# EAGLE design FEZ Panda (EAGLE 5.04)
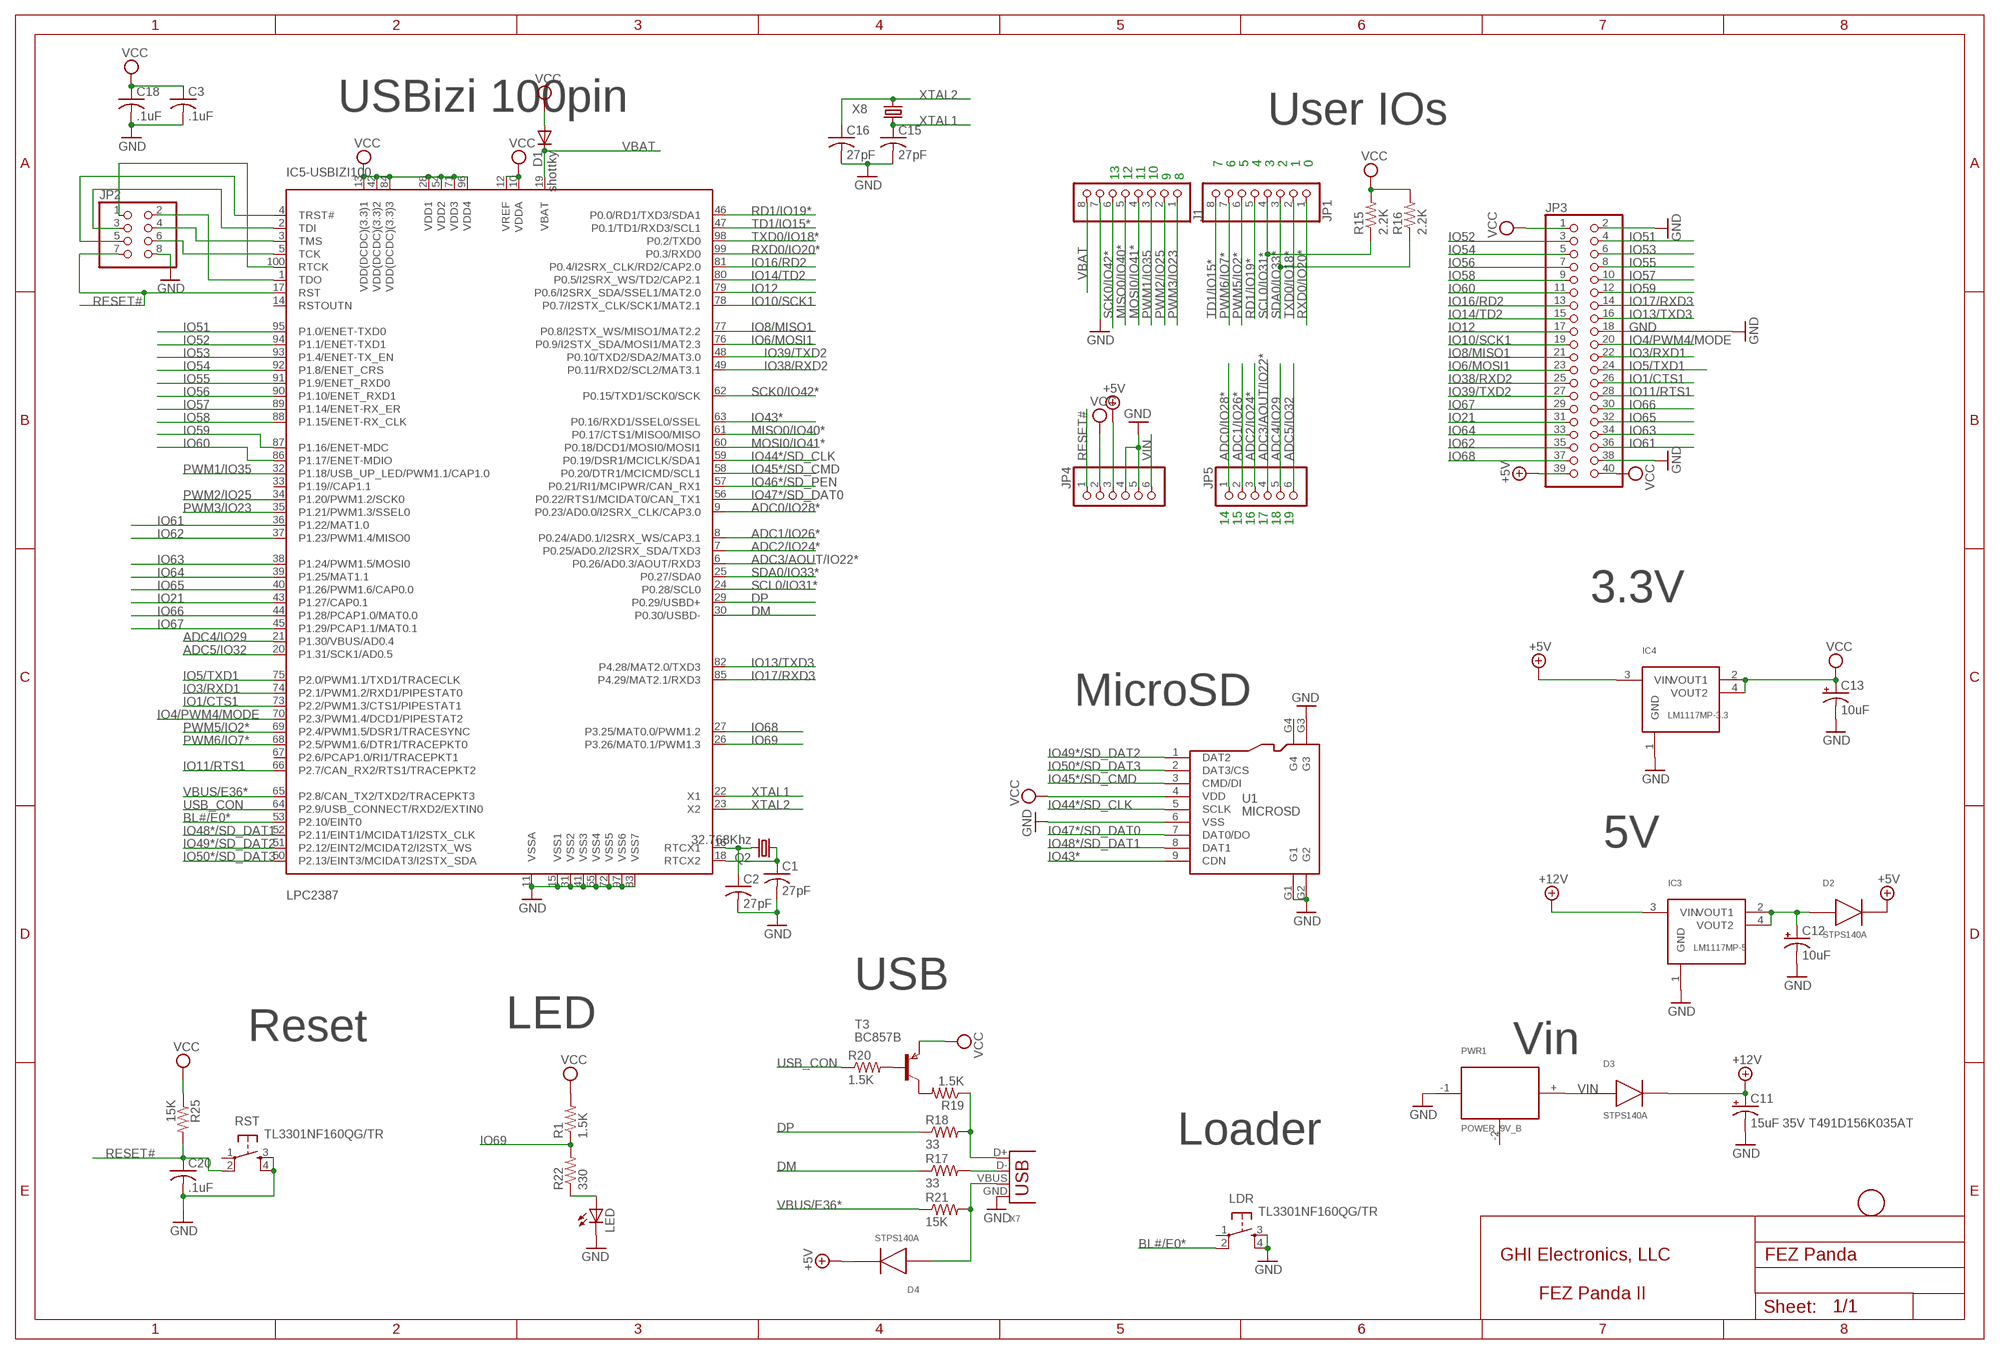
[diagram p0: schematic, sheet 1]

## Parts
C1  27pF  C-USC0603K  [C0603K]
C2  27pF  C-USC0603K  [C0603K]
C3  .1uF  C-USC0603K  [C0603K]
C11  15uF 35V T491D156K035AT  CPOL-USD/7343-31W  [D/7343-31W]
C12  10uF  CPOL-USCT3528  [CT3528]
C13  10uF  CPOL-USCT3528  [CT3528]
C15  27pF  C-USC0603K  [C0603K]
C16  27pF  C-USC0603K  [C0603K]
C18  .1uF  C-USC0603K  [C0603K]
C20  .1uF  C-USC0603K  [C0603K]
D1  shottky  DIODE-SOD323-W  [SOD323-W]
D2  STPS140A  DIODE_SMA  [DIODE_SMA]
D3  STPS140A  DIODE_SMA  [DIODE_SMA]
D4  STPS140A  DIODE_SMA  [DIODE_SMA]
IC3  LM1117MP-5  LM1117  [SOT223]
IC4  LM1117MP-3.3  LM1117  [SOT223]
IC5-USBIZI100  LPC2387  LPC2368  [LQFP100]
J1  PINHD-1X8  [1X08]
JP1  PINHD-1X8  [1X08]
JP2  PINHD-2X4  [2X04]
JP3  PINHD-2X20  [2X20]
JP4  PINHD-1X6  [1X06]
JP5  PINHD-1X6  [1X06]
LDR  TL3301NF160QG/TR  DTSM-6  [DTSM-6]
LED  LEDCHIPLED_0805  [CHIPLED_0805]
PWR1  POWER_9V_B  [POWER_9V_B]
Q2  32.768Khz  CRYSTALTC38H  [TC38H]
R1  1.5K  R-US_R0603  [R0603]
R15  2.2K  R-US_R0603  [R0603]
R16  2.2K  R-US_R0603  [R0603]
R17  33  R-US_R0603  [R0603]
R18  33  R-US_R0603  [R0603]
R19  1.5K  R-US_R0603  [R0603]
R20  1.5K  R-US_R0603  [R0603]
R21  15K  R-US_R0603  [R0603]
R22  330  R-US_R0603  [R0603]
R25  15K  R-US_R0603  [R0603]
RST  TL3301NF160QG/TR  DTSM-6  [DTSM-6]
T3  BC857B  PNPSOT23  [SOT-23]
U1  MICROSD  [MICROSD]
U$1  FIDUCIALMOUNT  [FIDUCIA-MOUNT]
X7  DX2R005HN2E700  USB-MB-S  [USB-MB-S]
X8  12Mhz  CRYTALSM49  [SM49@1]

## Nets
+5V: D2.K D4.K IC4.3(VIN) JP3.39 JP4.3
+12V: C11.+ D3.K IC3.3(VIN)
ADC0/IO28*: IC5-USBIZI100.9(P0.23/AD0.0/I2SRX_CLK/CAP3.0) JP5.1
ADC1/IO26*: IC5-USBIZI100.8(P0.24/AD0.1/I2SRX_WS/CAP3.1) JP5.2
ADC2/IO24*: IC5-USBIZI100.7(P0.25/AD0.2/I2SRX_SDA/TXD3) JP5.3
ADC3/AOUT/IO22*: IC5-USBIZI100.6(P0.26/AD0.3/AOUT/RXD3) JP5.4
ADC4/IO29: IC5-USBIZI100.21(P1.30/VBUS/AD0.4) JP5.5
ADC5/IO32: IC5-USBIZI100.20(P1.31/SCK1/AD0.5) JP5.6
BL#/E0*: IC5-USBIZI100.53(P2.10/EINT0) LDR.2
DM: IC5-USBIZI100.30(P0.30/USBD-) R17.1
DP: IC5-USBIZI100.29(P0.29/USBD+) R18.1
GND: C1.2 C2.2 C3.2 C11.- C12.- C13.- C15.2 C16.2 C18.2 C20.2 IC3.1(GND) IC4.1(GND) IC5-USBIZI100.11(VSSA) IC5-USBIZI100.15(VSS1) IC5-USBIZI100.31(VSS2) IC5-USBIZI100.41(VSS3) IC5-USBIZI100.55(VSS4) IC5-USBIZI100.72(VSS5) IC5-USBIZI100.83(VSS7) IC5-USBIZI100.97(VSS6) J1.7 JP2.8 JP3.2 JP3.18 JP3.38 JP4.4 JP4.5 LDR.3 LDR.4 LED.C PWR1.-1 RST.3 RST.4 U1.6(VSS) U1.G1 U1.G2 U1.G3 X7.GND
IO1/CTS1: IC5-USBIZI100.73(P2.2/PWM1.3/CTS1/PIPESTAT1) JP3.26
IO3/RXD1: IC5-USBIZI100.74(P2.1/PWM1.2/RXD1/PIPESTAT0) JP3.22
IO4/PWM4/MODE: IC5-USBIZI100.70(P2.3/PWM1.4/DCD1/PIPESTAT2) JP3.20
IO5/TXD1: IC5-USBIZI100.75(P2.0/PWM1.1/TXD1/TRACECLK) JP3.24
IO6/MOSI1: IC5-USBIZI100.76(P0.9/I2STX_SDA/MOSI1/MAT2.3) JP3.23
IO8/MISO1: IC5-USBIZI100.77(P0.8/I2STX_WS/MISO1/MAT2.2) JP3.21
IO10/SCK1: IC5-USBIZI100.78(P0.7/I2STX_CLK/SCK1/MAT2.1) JP3.19
IO11/RTS1: IC5-USBIZI100.66(P2.7/CAN_RX2/RTS1/TRACEPKT2) JP3.28
IO12: IC5-USBIZI100.79(P0.6/I2SRX_SDA/SSEL1/MAT2.0) JP3.17
IO13/TXD3: IC5-USBIZI100.82(P4.28/MAT2.0/TXD3) JP3.16
IO14/TD2: IC5-USBIZI100.80(P0.5/I2SRX_WS/TD2/CAP2.1) JP3.15
IO16/RD2: IC5-USBIZI100.81(P0.4/I2SRX_CLK/RD2/CAP2.0) JP3.13
IO17/RXD3: IC5-USBIZI100.85(P4.29/MAT2.1/RXD3) JP3.14
IO21: IC5-USBIZI100.43(P1.27/CAP0.1) JP3.31
IO38/RXD2: IC5-USBIZI100.49(P0.11/RXD2/SCL2/MAT3.1) JP3.25
IO39/TXD2: IC5-USBIZI100.48(P0.10/TXD2/SDA2/MAT3.0) JP3.27
IO43*: IC5-USBIZI100.63(P0.16/RXD1/SSEL0/SSEL) U1.9(CDN)
IO44*/SD_CLK: IC5-USBIZI100.59(P0.19/DSR1/MCICLK/SDA1) U1.5(SCLK)
IO45*/SD_CMD: IC5-USBIZI100.58(P0.20/DTR1/MCICMD/SCL1) U1.3(CMD/DI)
IO46*/SD_PEN: IC5-USBIZI100.57(P0.21/RI1/MCIPWR/CAN_RX1)
IO47*/SD_DAT0: IC5-USBIZI100.56(P0.22/RTS1/MCIDAT0/CAN_TX1) U1.7(DAT0/DO)
IO48*/SD_DAT1: IC5-USBIZI100.52(P2.11/EINT1/MCIDAT1/I2STX_CLK) U1.8(DAT1)
IO49*/SD_DAT2: IC5-USBIZI100.51(P2.12/EINT2/MCIDAT2/I2STX_WS) U1.1(DAT2)
IO50*/SD_DAT3: IC5-USBIZI100.50(P2.13/EINT3/MCIDAT3/I2STX_SDA) U1.2(DAT3/CS)
IO51: IC5-USBIZI100.95(P1.0/ENET-TXD0) JP3.4
IO52: IC5-USBIZI100.94(P1.1/ENET-TXD1) JP3.3
IO53: IC5-USBIZI100.93(P1.4/ENET-TX_EN) JP3.6
IO54: IC5-USBIZI100.92(P1.8/ENET_CRS) JP3.5
IO55: IC5-USBIZI100.91(P1.9/ENET_RXD0) JP3.8
IO56: IC5-USBIZI100.90(P1.10/ENET_RXD1) JP3.7
IO57: IC5-USBIZI100.89(P1.14/ENET-RX_ER) JP3.10
IO58: IC5-USBIZI100.88(P1.15/ENET-RX_CLK) JP3.9
IO59: IC5-USBIZI100.87(P1.16/ENET-MDC) JP3.12
IO60: IC5-USBIZI100.86(P1.17/ENET-MDIO) JP3.11
IO61: IC5-USBIZI100.36(P1.22/MAT1.0) JP3.36
IO62: IC5-USBIZI100.37(P1.23/PWM1.4/MISO0) JP3.35
IO63: IC5-USBIZI100.38(P1.24/PWM1.5/MOSI0) JP3.34
IO64: IC5-USBIZI100.39(P1.25/MAT1.1) JP3.33
IO65: IC5-USBIZI100.40(P1.26/PWM1.6/CAP0.0) JP3.32
IO66: IC5-USBIZI100.44(P1.28/PCAP1.0/MAT0.0) JP3.30
IO67: IC5-USBIZI100.45(P1.29/PCAP1.1/MAT0.1) JP3.29
IO68: IC5-USBIZI100.27(P3.25/MAT0.0/PWM1.2) JP3.37
IO69: IC5-USBIZI100.26(P3.26/MAT0.1/PWM1.3) R1.1 R22.2
MISO0/IO40*: IC5-USBIZI100.61(P0.17/CTS1/MISO0/MISO) J1.5
MOSI0/IO41*: IC5-USBIZI100.60(P0.18/DCD1/MOSI0/MOSI1) J1.4
N$1: IC5-USBIZI100.2(TDI) JP2.3
N$2: IC5-USBIZI100.3(TMS) JP2.4
N$3: IC5-USBIZI100.5(TCK) JP2.6
N$4: IC5-USBIZI100.100(RTCK) JP2.1
N$5: IC5-USBIZI100.1(TDO) JP2.2
N$6: R18.2 R19.1 X7.D+
N$7: R17.2 X7.D-
N$8: R20.2 T3.3(B)
N$9: IC5-USBIZI100.4(TRST#) JP2.5
N$10: R19.2 T3.1(C)
N$11: D4.A R21.2 X7.VBUS
N$12: LED.A R22.1
N$13: C2.1 IC5-USBIZI100.16(RTCX1) Q2.2
N$14: C1.1 IC5-USBIZI100.18(RTCX2) Q2.1
N$15: C12.+ D2.A IC3.2(VOUT1) IC3.4(VOUT2)
PWM1/IO35: IC5-USBIZI100.32(P1.18/USB_UP_LED/PWM1.1/CAP1.0) J1.3
PWM2/IO25: IC5-USBIZI100.34(P1.20/PWM1.2/SCK0) J1.2
PWM3/IO23: IC5-USBIZI100.35(P1.21/PWM1.3/SSEL0) J1.1
PWM5/IO2*: IC5-USBIZI100.69(P2.4/PWM1.5/DSR1/TRACESYNC) JP1.6
PWM6/IO7*: IC5-USBIZI100.68(P2.5/PWM1.6/DTR1/TRACEPKT0) JP1.7
RD1/IO19*: IC5-USBIZI100.46(P0.0/RD1/TXD3/SDA1) JP1.5
RESET#: C20.1 IC5-USBIZI100.17(RST) JP2.7 JP4.1 R25.2 RST.2
RXD0/IO20*: IC5-USBIZI100.99(P0.3/RXD0) JP1.1
SCK0/IO42*: IC5-USBIZI100.62(P0.15/TXD1/SCK0/SCK) J1.6
SCL0/IO31*: IC5-USBIZI100.24(P0.28/SCL0) JP1.4 R15.1
SDA0/IO33*: IC5-USBIZI100.25(P0.27/SDA0) JP1.3 R16.1
TD1/IO15*: IC5-USBIZI100.47(P0.1/TD1/RXD3/SCL1) JP1.8
TXD0/IO18*: IC5-USBIZI100.98(P0.2/TXD0) JP1.2
USB_CON: IC5-USBIZI100.64(P2.9/USB_CONNECT/RXD2/EXTIN0) R20.1
VBAT: D1.C IC5-USBIZI100.19(VBAT) J1.8
VBUS/E36*: IC5-USBIZI100.65(P2.8/CAN_TX2/TXD2/TRACEPKT3) R21.1
VCC: C3.1 C13.+ C18.1 D1.A IC4.2(VOUT1) IC4.4(VOUT2) IC5-USBIZI100.10(VDDA) IC5-USBIZI100.12(VREF) IC5-USBIZI100.13(VDD(DCDC)(3.3)1) IC5-USBIZI100.28(VDD1) IC5-USBIZI100.42(VDD(DCDC)(3.3)2) IC5-USBIZI100.54(VDD2) IC5-USBIZI100.71(VDD3) IC5-USBIZI100.84(VDD(DCDC)(3.3)3) IC5-USBIZI100.96(VDD4) JP3.1 JP3.40 JP4.2 R1.2 R15.2 R16.2 R25.1 T3.2(E) U1.4(VDD)
VIN: D3.A JP4.6 PWR1.+
XTAL1: C15.1 IC5-USBIZI100.22(X1) X8.1
XTAL2: C16.1 IC5-USBIZI100.23(X2) X8.2
Unconnected: IC5-USBIZI100.14(RSTOUTN) IC5-USBIZI100.33(P1.19//CAP1.1) IC5-USBIZI100.67(P2.6/PCAP1.0/RI1/TRACEPKT1) LDR.1 PWR1.-2 RST.1 U1.G4

## Notes on the sheet
- USBizi 100pin | User IOs
- 7 | 6 | 5 | 4 | 3 | 2 | 1 | 0
- 13 | 12 | 11 | 10 | 9 | 8
- 14 | 15 | 16 | 17 | 18 | 19
- 3.3V
- MicroSD
- 5V
- USB
- Reset | LED
- Vin
- Loader
- GHI Electronics, LLC
- FEZ Panda II

## Library data of the parts
C1-C3 C15 C16 C18 C20 = rcl:C-US: CAPACITOR, American symbol
C11-C13 = rcl:CPOL-US: POLARIZED CAPACITOR, American symbol
D1 = diode:DIODE-: DIODE
D2-D4 = GHI:DIODE_SMA
IC3 IC4 = GHI:LM1117
IC5-USBIZI100 = GHI:LPC2368
J1 JP1 = pinhead:PINHD-1X8: PIN HEADER
JP2 = pinhead:PINHD-2X4: PIN HEADER
JP3 = pinhead:PINHD-2X20: PIN HEADER
JP4 JP5 = pinhead:PINHD-1X6: PIN HEADER
LDR RST = switch-tact:DTSM-6
LED = led:LED: LED OSRAM: - CHIPLED LG R971, LG N971, LY N971, LG Q971, LY Q971, LO R971, LY R971 LH N974, LH R974 LS Q976, LO Q976, LY Q976 LO Q996 - Hyper CHIPLED LW Q18S LB Q993, LB Q99A, LB R99A - SideLED LS A670, LO A670, LY A670, LG A670, LP A670 LB A673, LV A673, LT A673, LW A673 LH A674 LY A675 LS A676, LA A676, LO A676, LY A676, LW A676 LS A679, LY A679, LG A679 - Hyper Micro SIDELED® LS Y876, LA Y876, LO Y876, LY Y876 LT Y87S - SmartLED LW L88C, LW L88S LB L89C, LB L89S, LG L890 LS L89K, LO L89K, LY L89K LS L896, LA L896, LO L896, LY L896 - TOPLED LS T670, LO T670, LY T670, LG T670, LP T670 LSG T670, LSP T670, LSY T670, LOP T670, LYG T670 LG T671, LOG T671, LSG T671 LB T673, LV T673, LT T673, LW T673 LH T674 LS T676, LA T676, LO T676, LY T676, LB T676, LH T676, LSB T676, LW T676 LB T67C, LV T67C, LT T67C, LS T67K, LO T67K, LY T67K, LW E67C LS E67B, LA E67B, LO E67B, LY E67B, LB E67C, LV E67C, LT E67C LW T67C LS T679, LY T679, LG T679 LS T770, LO T770, LY T770, LG T770, LP T770 LB T773, LV T773, LT T773, LW T773 LH T774 LS E675, LA E675, LY E675, LS T675 LS T776, LA T776, LO T776, LY T776, LB T776 LHGB T686 LT T68C, LB T68C - Hyper Mini TOPLED® LB M676 - Mini TOPLED Santana® LG M470 LS M47K, LO M47K, LY M47K Source: http://www.osram.convergy.de LUXEON: - LUMILED® LXK2-PW12-R00, LXK2-PW12-S00, LXK2-PW14-U00, LXK2-PW14-V00 LXK2-PM12-R00, LXK2-PM12-S00, LXK2-PM14-U00 LXK2-PE12-Q00, LXK2-PE12-R00, LXK2-PE12-S00, LXK2-PE14-T00, LXK2-PE14-U00 LXK2-PB12-K00, LXK2-PB12-L00, LXK2-PB12-M00, LXK2-PB14-N00, LXK2-PB14-P00, LXK2-PB14-Q00 LXK2-PR12-L00, LXK2-PR12-M00, LXK2-PR14-Q00, LXK2-PR14-R00 LXK2-PD12-Q00, LXK2-PD12-R00, LXK2-PD12-S00 LXK2-PH12-R00, LXK2-PH12-S00 LXK2-PL12-P00, LXK2-PL12-Q00, LXK2-PL12-R00 Source: www.luxeon.com KINGBRIGHT: KA-3528ASYC Source: www.kingbright.com
PWR1 = CONNECTER:POWER_9V_B
Q2 = crystal:CRYSTAL: CRYSTAL
R1 R15-R22 R25 = rcl:R-US_: RESISTOR, American symbol
T3 = zetex:PNPSOT23: PNP TRANSISTOR
U1 = microSD:MICROSD
U$1 = SmartPrj:FIDUCIALMOUNT
X7 = con-usb-3:USB: USB Connectors
X8 = crystal:CRYTAL: CRYSTAL

## Net classes
0 default: width 0.254 mm, drill 0.381 mm, clearance 0.203 mm
2 gnd: width 0.254 mm, drill 0.381 mm, clearance 0.203 mm
3 usbvcc: width 0.508 mm, drill 0.508 mm, clearance 2.235 mm

## Board
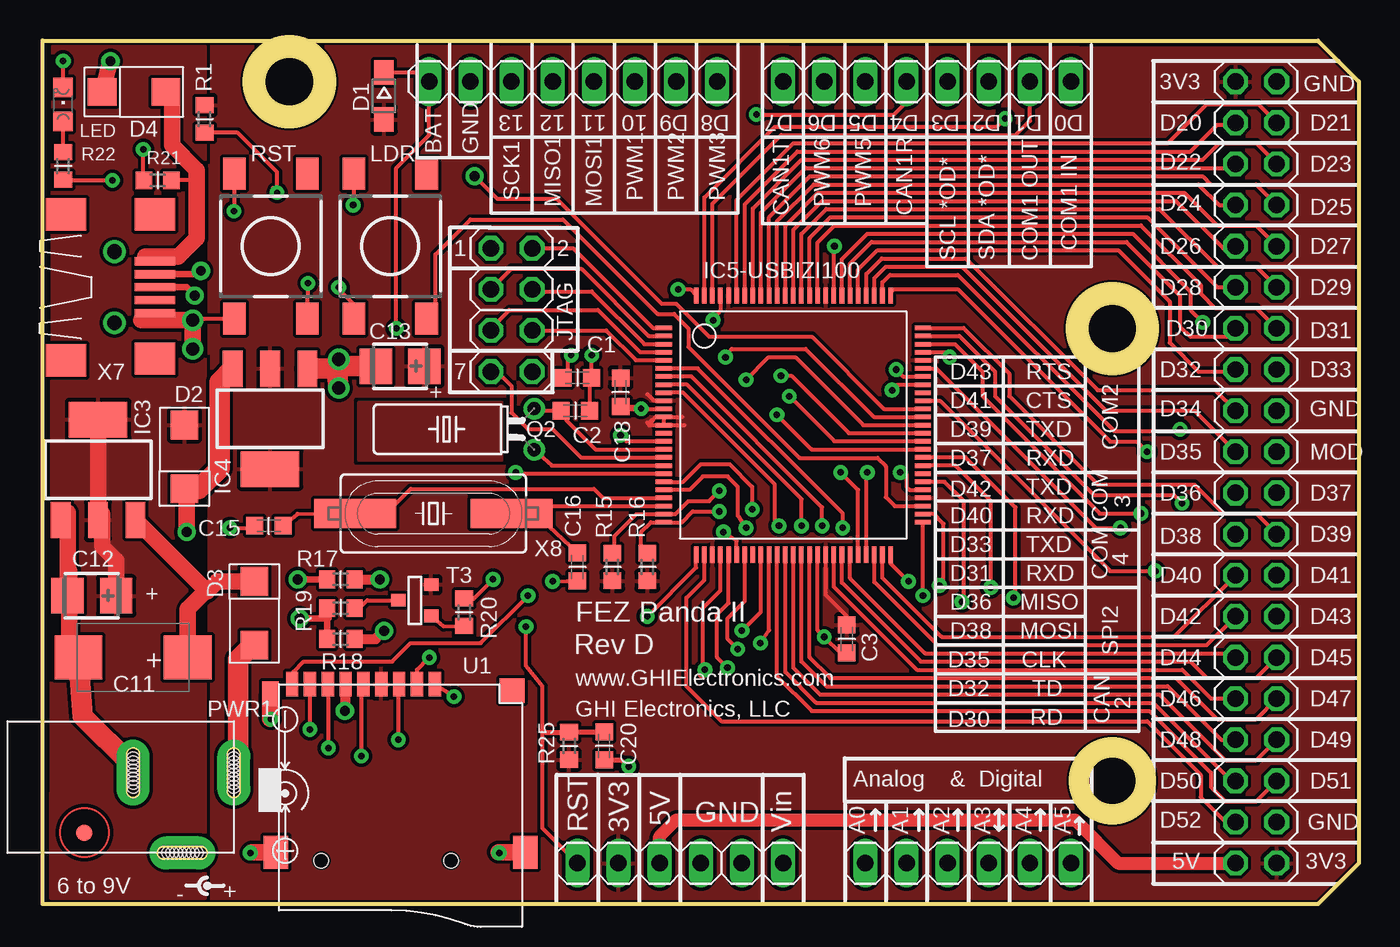
[diagram p1: board, top side]
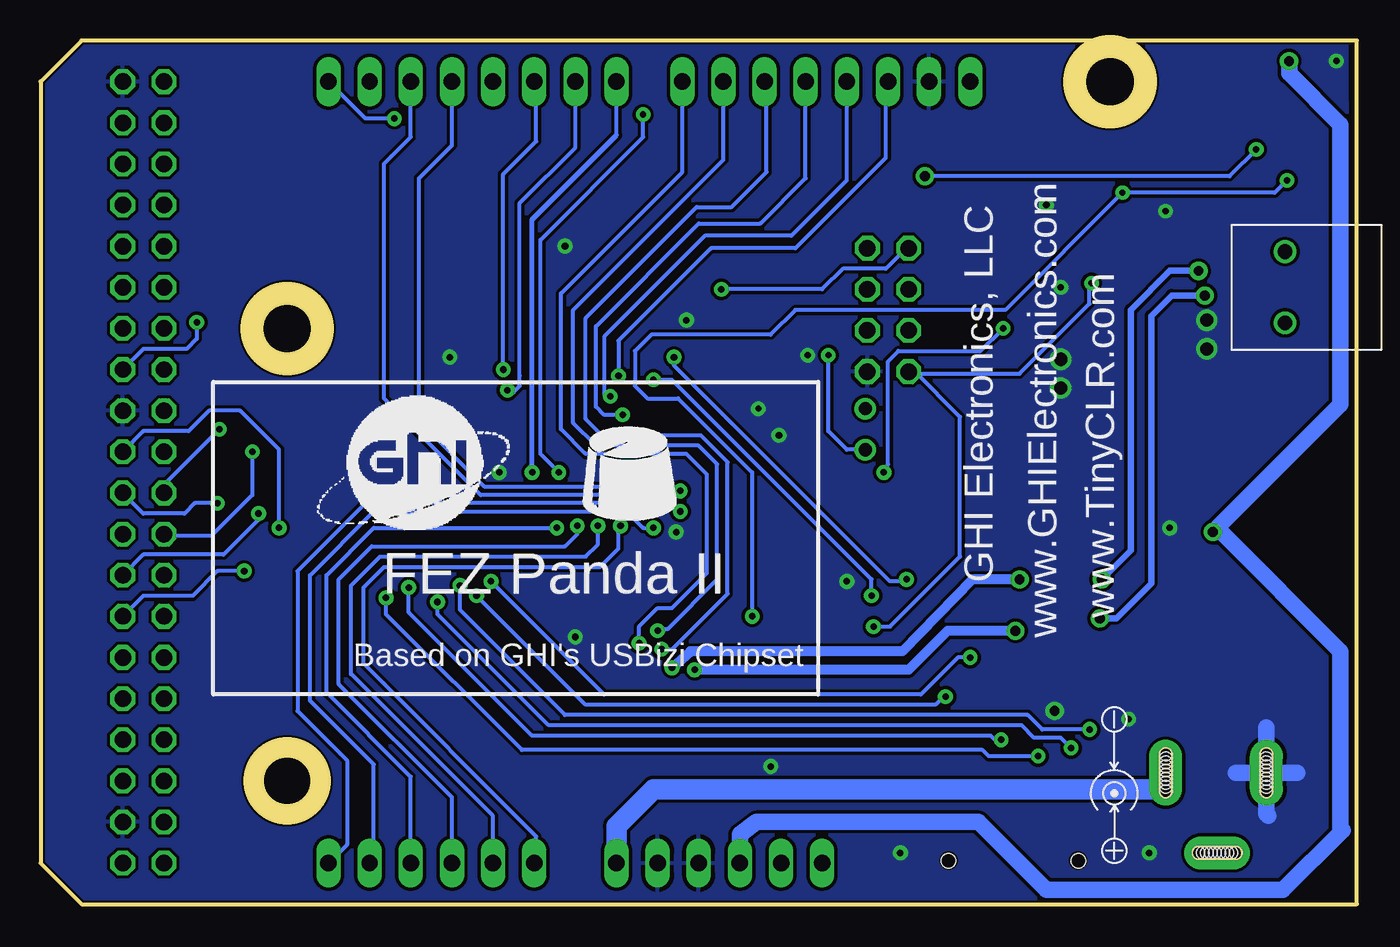
[diagram p2: board, bottom side, seen from below]

Size 81.28 x 53.34 mm. Coordinates in mm from the lower left corner, seen from the top.
Outline: 78.74,53.34 81.28,50.8 81.28,2.54 78.74,0 0,0 0,53.34 78.74,53.34
Outline: circle at 66.04,35.56 radius 2.16
Outline: circle at 15.24,50.8 radius 2.16
Outline: circle at 66.04,7.62 radius 2.05
Copper layers (1+16): Top 0.035mm / dielectric 1.5mm / Bottom 0.035mm
Design rules "default *": minimum track width 6mil, minimum drill 12mil, track to track 6mil, track to pad 6mil, pad to pad 6mil, via to via 6mil, smd to smd 6mil, copper to edge 5mil, drill to drill 6mil, minimum pad ring 10mil, minimum via ring 10mil, stop-mask expansion 10mil, vias tented up to drill 32mil, thermal gap 10mil
Holes 3.2 mm at 66.04,35.56 66.04,7.62 15.24,50.8

### Footprints (pad centres in the part's own frame; a part is rotated, then mirrored left to right if it is on the bottom)
C0603K = smd 1.05 x 1.08: 1 -0.875,0; 2 0.875,0
D/7343-31W = smd 2.95 x 2.7: + 3.375,0; - -3.375,0
CT3528 = smd 2 x 2.2: + 1.5,0; - -1.5,0
SOD323-W = smd 1.5 x 1.2: A 1.45,0; C -1.45,0
DIODE_SMA = smd 1.778 x 1.676: A -1.905,0; K 2.032,0
SOT223 = smd 1.219 x 2.235: 1 -2.311,-3.099; 2 0,-3.099; 3 2.311,-3.099 | smd 3.6 x 2.2: 4 0,3.099
LQFP100 = smd 0.28 x 1: 1 -6,-8; 2 -5.5,-8; 3 -5,-8; 4 -4.5,-8; 5 -4,-8; 6 -3.5,-8; 7 -3,-8; 8 -2.5,-8; 9 -2,-8; 10 -1.5,-8; 11 -1,-8; 12 -0.5,-8; 13 0,-8; 14 0.5,-8; 15 1,-8; 16 1.5,-8; 17 2,-8; 18 2.5,-8; 19 3,-8; 20 3.5,-8; 21 4,-8; 22 4.5,-8; 23 5,-8; 24 5.5,-8; 25 6,-8; 51 6,8; 52 5.5,8; 53 5,8; 54 4.5,8; 55 4,8; 56 3.5,8; 57 3,8; 58 2.5,8; 59 2,8; 60 1.5,8; 61 1,8; 62 0.5,8; 63 0,8; 64 -0.5,8; 65 -1,8; 66 -1.5,8; 67 -2,8; 68 -2.5,8; 69 -3,8; 70 -3.5,8; 71 -4,8; 72 -4.5,8; 73 -5,8; 74 -5.5,8; 75 -6,8 | smd 1 x 0.28: 26 8,-6; 27 8,-5.5; 28 8,-5; 29 8,-4.5; 30 8,-4; 31 8,-3.5; 32 8,-3; 33 8,-2.5; 34 8,-2; 35 8,-1.5; 36 8,-1; 37 8,-0.5; 38 8,0; 39 8,0.5; 40 8,1; 41 8,1.5; 42 8,2; 43 8,2.5; 44 8,3; 45 8,3.5; 46 8,4; 47 8,4.5; 48 8,5; 49 8,5.5; 50 8,6; 76 -8,6; 77 -8,5.5; 78 -8,5; 79 -8,4.5; 80 -8,4; 81 -8,3.5; 82 -8,3; 83 -8,2.5; 84 -8,2; 85 -8,1.5; 86 -8,1; 87 -8,0.5; 88 -8,0; 89 -8,-0.5; 90 -8,-1; 91 -8,-1.5; 92 -8,-2; 93 -8,-2.5; 94 -8,-3; 95 -8,-3.5; 96 -8,-4; 97 -8,-4.5; 98 -8,-5; 99 -8,-5.5; 100 -8,-6
1X08 = drill 1.016 long: 1 -8.89,0; 2 -6.35,0; 3 -3.81,0; 4 -1.27,0; 5 1.27,0; 6 3.81,0; 7 6.35,0; 8 8.89,0
2X04 = drill 1.016 octagon: 1 -3.81,-1.27; 2 -3.81,1.27; 3 -1.27,-1.27; 4 -1.27,1.27; 5 1.27,-1.27; 6 1.27,1.27; 7 3.81,-1.27; 8 3.81,1.27
2X20 = drill 1.016 octagon: 1 -24.13,-1.27; 2 -24.13,1.27; 3 -21.59,-1.27; 4 -21.59,1.27; 5 -19.05,-1.27; 6 -19.05,1.27; 7 -16.51,-1.27; 8 -16.51,1.27; 9 -13.97,-1.27; 10 -13.97,1.27; 11 -11.43,-1.27; 12 -11.43,1.27; 13 -8.89,-1.27; 14 -8.89,1.27; 15 -6.35,-1.27; 16 -6.35,1.27; 17 -3.81,-1.27; 18 -3.81,1.27; 19 -1.27,-1.27; 20 -1.27,1.27; 21 1.27,-1.27; 22 1.27,1.27; 23 3.81,-1.27; 24 3.81,1.27; 25 6.35,-1.27; 26 6.35,1.27; 27 8.89,-1.27; 28 8.89,1.27; 29 11.43,-1.27; 30 11.43,1.27; 31 13.97,-1.27; 32 13.97,1.27; 33 16.51,-1.27; 34 16.51,1.27; 35 19.05,-1.27; 36 19.05,1.27; 37 21.59,-1.27; 38 21.59,1.27; 39 24.13,-1.27; 40 24.13,1.27
1X06 = drill 1.016 long: 1 -6.35,0; 2 -3.81,0; 3 -1.27,0; 4 1.27,0; 5 3.81,0; 6 6.35,0
DTSM-6 = smd 2 x 1.4: 1 -4.475,2.25; 2 4.475,2.25; 3 -4.475,-2.25; 4 4.475,-2.25
CHIPLED_0805 = smd 1.2 x 1.2: A 0,-1.05; C 0,1.05
POWER_9V_B = drill 0.762 pad 2.032 long: + 3.175,0; -1 -3.048,0; -2 0,-4.953 | hole 0.762: -3.048,1.143; -3.048,0.889; -3.048,0.635; -3.048,0.381; -3.048,0.127; -3.048,-0.127; -3.048,-0.381; -3.048,-0.635; -3.048,-0.889; -3.048,-1.143; 3.175,1.143; 3.175,0.889; 3.175,0.635; 3.175,0.381; 3.175,0.127; 3.175,-0.127; 3.175,-0.381; 3.175,-0.635; 3.175,-0.889; 3.175,-1.143; -1.143,-4.953; -0.889,-4.953; -0.635,-4.953; -0.381,-4.953; -0.127,-4.953; 0.127,-4.953; 0.381,-4.953; 0.635,-4.953; 0.889,-4.953; 1.143,-4.953
TC38H = drill 0.813 round: 1 -1.27,0; 2 1.27,0
R0603 = smd 1 x 1.1: 1 -0.85,0; 2 0.85,0
SOT-23 = smd 0.787 x 0.889: 1 0.025,-1.016; 2 -0.94,1.016; 3 0.991,1.016
MICROSD = smd 1.524 x 0.762: 1 0,4.4; 2 0,3.3; 3 0,2.2; 4 0,1.1; 5 0,0; 6 0,-1.1; 7 0,-2.2; 8 0,-3.3; 9 0,-4.4 | smd 1.524 x 1.016: G1 0.6,-5.746 | smd 2.032 x 1.524: G2 10.373,-5.4; G3 10.373,10 | smd 1.524 x 1.524: G4 0.392,9.181 | hole 0.889: 10.9,-2.6; 10.9,5.4
FIDUCIA-MOUNT = smd 1.016 x 1.016: P$1 0,0
USB-MB-S = smd 2.5 x 0.5: D+ 2.5,0; D- 2.5,0.8; GND 2.5,-1.6; ID 2.5,-0.8; VBUS 2.5,1.6 | smd 2.5 x 2: P$1 -3,-4.5; P$2 -3,4.5; P$3 2.5,-4.4; P$4 2.5,4.5 | drill 0.9 round: P$5 0,2.2; P$6 0,-2.2
SM49@1 = smd 5.08 x 1.778: 1 -4.826,0; 2 4.826,0

### Placement (x,y rotation side)
C1  33.02,32.51 0 top
C2  32.89,30.48 0 top
C3  49.66,16.38 270 top
C11  5.59,15.24 0 top
C12  3.05,19.05 0 top
C13  22.07,33.22 0 top
C15  13.97,23.37 180 top
C16  33.02,20.83 270 top
C18  35.69,31.62 270 top
C20  34.67,9.78 270 top
D1  21.08,49.91 270 top
D2  8.76,27.69 270 top
D3  13.08,17.91 90 top
D4  5.71,50.16 180 top
IC3  3.43,26.82 0 top
IC4  14.05,29.97 180 top
IC5-USBIZI100  46.35,29.59 270 top
J1  32.77,50.8 180 top
JP1  54.61,50.8 180 top
JP2  28.96,36.7 270 top
JP3  74.93,26.67 270 top
JP4  39.37,2.54 0 top
JP5  57.15,2.54 0 top
LDR  21.46,40.64 270 top
LED  1.27,49.4 0 top
PWR1  8.64,8.13 0 top
Q2  30.35,29.34 90 top
R1  10.01,48.49 90 top
R15  35.18,20.83 270 top
R16  37.34,20.83 270 top
R17  18.41,20.07 180 top
R18  18.41,16.38 180 top
R19  18.41,18.29 0 top
R20  26.04,18.03 270 top
R21  7.11,44.7 0 top
R22  1.27,45.59 270 top
R25  32.51,9.78 90 top
RST  14.1,40.64 270 top
T3  22.99,18.8 270 top
U1  19.81,13.59 270 top
U$1  2.59,4.43 0 top
X7  4.45,38.1 0 top
X8  24.13,24.13 0 top

### Tracks (layer width: path | path; a pad name or v marks a point on that pad's centre or on a via)
+5V  (via drill 0.61)
  Top 0.813: JP3.39 66.42,2.54 63.75,5.21 39.12,5.21 38.1,4.19 JP4.3
  Top 1.016: v4.19,52.07 D4.K | v8.89,22.99 8.89,25.4 D2.K
  Top 1.27: D2.K 9.65,25.65 10.92,26.92 10.92,32.26 IC4.3
  Bottom 1.016: JP4.3 38.1,4.32 37.08,5.08 23.37,5.08 19.18,0.89 4.57,0.89 0.89,4.57 1.02,4.7 1.02,15.62 8.38,22.99 v8.89,22.99 1.02,30.86 1.02,48.13 4.19,51.31 v4.19,52.07
+12V
  Top 1.016: IC3.3 10.03,19.43 10.16,19.43 | 10.16,19.43 10.16,19.3 10.79,19.94 D3.K | C11.+ 8.96,18.23 10.16,19.43
ADC0/IO28*  (via drill 0.41)
  Top 0.254: IC5-USBIZI100.9 39.53,31.59 45.21,25.91 45.21,23.75 v45.47,23.37
  Bottom 0.254: v45.47,23.37 45.59,23.5 45.59,21.97 46.74,20.83 60.07,20.83 61.34,19.56 61.34,14.86 50.67,4.19 50.67,2.67 JP5.1
ADC1/IO26*  (via drill 0.41)
  Top 0.254: IC5-USBIZI100.8 39.79,32.09 46.86,25.02 v46.86,23.37
  Bottom 0.254: 47.12,23.37 v46.86,23.37 46.86,22.23 47.62,21.46 60.33,21.46 62.1,19.68 62.1,14.22 53.34,5.46 JP5.2
ADC2/IO24*  (via drill 0.41)
  Top 0.254: IC5-USBIZI100.7 40.05,32.59 48.13,24.51 v48.13,23.37
  Bottom 0.254: 48.13,23.5 v48.13,23.37 48.13,22.86 48.9,22.1 60.83,22.1 62.87,20.07 62.87,13.59 55.88,6.6 JP5.3
ADC3/AOUT/IO22*  (via drill 0.41)
  Top 0.254: IC5-USBIZI100.6 40.44,33.09 49.4,24.13 v49.4,23.24
  Bottom 0.254: v49.4,23.24 60.71,23.24 63.63,20.32 63.63,13.08 58.42,7.87 JP5.4
ADC4/IO29  (via drill 0.41)
  Top 0.254: IC5-USBIZI100.21 39.94,25.59 40.77,26.42 42.29,26.42 42.93,25.78 42.93,24 v43.43,23.24
  Bottom 0.254: 44.07,23.24 43.31,23.11 v43.43,23.24 | 44.07,23.24 43.81,23.24 | 44.07,23.24 45.09,24.26 60.71,24.26 64.64,20.32 64.64,12.57 60.71,8.64 60.71,2.79 JP5.5
ADC5/IO32  (via drill 0.41)
  Top 0.254: IC5-USBIZI100.20 39.55,26.09 40.64,27.18 42.42,27.18 43.81,25.78 v43.81,24.38 43.94,24.64
  Bottom 0.254: v43.81,24.38 44.32,24.77 61.21,24.77 65.41,20.57 65.41,11.94 62.36,8.89 62.36,3.68 JP5.6
BL#/E0*
  Top 0.254: IC5-USBIZI100.53 52.62,24.59 52.07,25.15 52.07,27.05 51.56,27.56 46.74,27.56 39.88,34.42 39.88,35.56 38.99,36.45 37.97,36.45 32.13,42.29 26.42,42.29 24.26,40.13 24.26,39.5 24.26,35.44 LDR.2
DM  (via drill 0.41, 0.61)
  Top 0.254: IC5-USBIZI100.30 42.35,18.61 41.66,17.91 41.66,15.24 v42.29,14.61
  Top 0.61: R17.1 v20.83,20.07
  Bottom 0.61: v42.29,14.61 41.15,15.62 28.07,15.62 23.75,20.07 v20.83,20.07
DP  (via drill 0.41, 0.61)
  Top 0.254: IC5-USBIZI100.29 41.85,19.38 40.77,18.29 40.77,14.22
  Top 0.61: v40.89,14.48 40.77,14.22 | R18.1 20.57,16.38 v21.08,16.89
  Bottom 0.61: v40.89,14.48 27.69,14.48 25.27,16.89 v21.08,16.89
GND  (via drill 0.38, 0.41, 0.61, 0.81)
  Top 0.254: IC5-USBIZI100.83 48.85,40.35 v48.9,40.64 | IC5-USBIZI100.15 36.05,28.59 v35.69,28.96 | IC5-USBIZI100.41 47.85,16.91 v48.26,16.51 49.26,15.51 C3.2 | LED.C v1.27,52.07 | LDR.3 19.21,44.48 v19.18,43.18 | LDR.4 19.34,36.36 19.3,36.96 18.29,37.97 v18.29,38.1 | IC5-USBIZI100.72 55.83,34.09 v56.01,33.78 | IC5-USBIZI100.55 53.53,25.59 53.34,25.78 53.34,26.54 v52.96,26.67 | IC5-USBIZI100.97 41.85,36.65 v41.4,36.07 | IC5-USBIZI100.31 42.85,22.42 v42.04,22.99 | C15.2 13.07,23.23 v11.56,23.24 | C16.2 32.4,19.95 v31.5,19.94 | RST.4 9.68,36.16 9.27,35.43 | v14.1,11.43 14.07,11.46 | 28.15,3.22 v28.19,3.17 | RST.3 11.85,43.14 v11.81,42.8 | v33.91,33.91 33.9,33.77 C1.2 33.77,32.38 C2.2 | IC5-USBIZI100.11 35.84,30.59 C18.2 36.82,30.75 v36.96,30.61
  Top 0.305: X7.GND 6.53,36.5 6.1,36.07 | C20.2 35.67,8.9 v36.2,8.51
  Top 0.406: 5.46,8.26 5.59,8.26 PWR1.-1
  Top 0.61: U1.6 18.71,12.53 v18.67,11.94 | 12.91,3.22 v12.83,3.17
  Top 1.016: 6.1,36.07 v9.27,36.07 9.27,35.43 v9.27,34.29 | 14.07,11.46 U1.G1 | U1.G3 28.15,3.22 | U1.G2 12.91,3.22 | C11.- 2.21,15.44 1.65,16 1.65,20.6 C12.- 1.55,24.18 IC3.1
  Top 1.27: C11.- 2.47,11.61 5.46,8.64 5.46,8.26 | IC4.1 18.11,33.07 18.16,33.02 v18.29,31.88 | C13.- 18.72,33.22 v18.29,33.66
  Bottom 1.016: 3.68,8.13 7.49,8.13 | 5.59,10.92 5.59,5.59 5.46,5.46
  pour Bottom: 0.64,53.59 82.04,53.59 82.04,0 0.64,0 0.64,10.67 0.51,21.46
IO1/CTS1  (via drill 0.41)
  Top 0.254: IC5-USBIZI100.73 56.34,34.59 58.04,32.89 58.04,31.37 65.28,24.13 v67.82,24.13
  Bottom 0.254: v67.82,24.13 67.82,23.75 69.98,21.59 74.93,21.59 JP3.26
IO3/RXD1  (via drill 0.41)
  Top 0.254: IC5-USBIZI100.74 56.6,35.09 58.8,32.89 58.8,31.37 64.9,25.27 69.85,25.27 v70.36,24.77
  Bottom 0.254: v70.36,24.77 71.75,24.77 72.39,24.13 74.93,24.13 JP3.22
IO4/PWM4/MODE  (via drill 0.41)
  Top 0.254: IC5-USBIZI100.70 55.17,33.09 65.02,23.24 v66.55,23.24
  Bottom 0.254: v66.55,23.24 66.55,28.07 68.96,30.48 70.87,30.48 72.14,29.21 74.93,29.21 JP3.20
IO5/TXD1
  Top 0.254: IC5-USBIZI100.75 56.87,35.59 59.69,32.77 59.69,31.37 65.15,25.91 71.12,25.91 72.9,24.13 74.93,24.13 JP3.24
IO6/MOSI1  (via drill 0.41)
  Top 0.254: IC5-USBIZI100.76 52.35,37.75 52.58,37.97 56.52,37.97 65.91,28.57 67.56,28.57 v68.2,27.94
  Bottom 0.254: v68.2,27.94 68.2,25.27 70.74,22.73 73.53,22.73 JP3.23
IO8/MISO1  (via drill 0.41)
  Top 0.254: IC5-USBIZI100.77 51.85,38.39 52.32,38.86 56.52,38.86 66.17,29.21 70.1,29.21 v70.23,29.34
  Bottom 0.254: v70.23,29.34 73.41,26.16 73.41,25.65 JP3.21
IO10/SCK1
  Top 0.254: IC5-USBIZI100.78 51.35,38.66 52.07,39.37 56.77,39.37 65.66,30.48 71.12,30.48 JP3.19
IO11/RTS1  (via drill 0.41)
  Top 0.254: IC5-USBIZI100.66 55.4,31.09 65.91,20.57 v68.71,20.57
  Bottom 0.254: v68.71,20.57 70.36,20.57 71.88,19.05 74.93,19.05 JP3.28
IO12
  Top 0.254: IC5-USBIZI100.79 50.85,38.92 51.82,39.88 57.02,39.88 65.15,31.75 72.39,31.75 JP3.17
IO13/TXD3  (via drill 0.41)
  Top 0.254: IC5-USBIZI100.82 49.35,39.83 50.93,41.4 67.31,41.4 70.87,37.85 70.87,36.7 v71.63,35.94
  Bottom 0.254: v71.63,35.94 71.63,34.92 72.26,34.29 74.93,34.29 JP3.16
IO14/TD2
  Top 0.254: IC5-USBIZI100.80 50.35,39.18 51.56,40.39 66.42,40.39 69.6,37.21 69.6,34.67 71.37,32.89 73.53,32.89 JP3.15
IO16/RD2
  Top 0.254: IC5-USBIZI100.81 49.85,39.57 51.18,40.89 66.93,40.89 70.23,37.59 70.23,35.69 70.87,35.05 73.15,35.05 JP3.13
IO17/RXD3
  Top 0.254: IC5-USBIZI100.85 47.85,40.87 48.9,41.91 67.82,41.91 71.5,38.23 71.5,37.72 72.39,36.83 74.93,36.83 JP3.14
IO21
  Top 0.254: IC5-USBIZI100.43 48.85,19.6 53.98,14.48 70.36,14.48 72.14,12.7 JP3.31
IO38/RXD2
  Top 0.254: IC5-USBIZI100.49 51.85,20.15 55.5,16.51 69.85,16.51 JP3.25
IO39/TXD2
  Top 0.254: IC5-USBIZI100.48 51.35,19.89 55.24,16 71.88,16 JP3.27
IO43*  (via drill 0.41)
  Top 0.254: IC5-USBIZI100.63 50.67,29.59 46.48,33.78 44.83,33.78 v43.43,32.38 | v29.97,19.05 27.05,16.13 22.73,16.13 21.59,14.99 16.13,14.99 15.49,14.35 15.49,13.67 U1.9
  Bottom 0.254: v43.43,32.38 42.29,32.38 29.97,20.07 v29.97,19.05
IO44*/SD_CLK  (via drill 0.41)
  Top 0.254: v19.68,9.14 19.68,13.08 U1.5 | IC5-USBIZI100.59 56.99,27.59 60.07,24.51 60.07,19.05 v59.94,18.92
  Bottom 0.254: v19.68,9.14 22.73,9.14 23.11,9.53 51.56,9.53 59.94,17.91 v59.94,18.92
IO45*/SD_CMD  (via drill 0.41)
  Top 0.254: v21.97,10.16 21.97,13.17 U1.3 | IC5-USBIZI100.58 56.35,27.09 58.55,24.89 v58.55,19.56
  Bottom 0.254: v21.97,10.16 22.1,9.91 22.61,10.41 50.93,10.41 58.55,18.03 v58.55,19.56
IO47*/SD_DAT0  (via drill 0.41)
  Top 0.254: v17.65,9.65 17.65,12.53 U1.7 | IC5-USBIZI100.56 55.7,26.09 56.9,24.89 56.9,18.92 v56.77,18.67
  Bottom 0.254: v56.77,18.67 56.77,17.91 49.91,11.05 20.7,11.05 19.94,10.29 18.29,10.29 v17.65,9.65
IO48*/SD_DAT1  (via drill 0.41)
  Top 0.254: v16.51,10.79 16.51,13.33 U1.8 | IC5-USBIZI100.52 55.03,24.09 55.63,23.5 55.63,19.81 v55.37,19.68
  Bottom 0.254: v55.37,19.68 55.37,18.16 48.9,11.68 20.32,11.68 19.43,10.79 v16.51,10.79
IO49*/SD_DAT2  (via drill 0.41)
  Top 0.254: IC5-USBIZI100.51 54.35,20.57 v54.36,19.05 | U1.1 v25.4,12.83
  Bottom 0.254: v25.4,12.83 25.53,12.83 26.04,12.32 47.62,12.32 v54.36,19.05
IO50*/SD_DAT3  (via drill 0.41)
  Top 0.254: v23.88,15.24 23.11,14.48 23.11,13.72 U1.2 | IC5-USBIZI100.50 52.35,21.05 v53.47,19.94
  Bottom 0.254: v23.88,15.24 24.64,15.24 26.92,12.95 46.48,12.95 v53.47,19.94
IO51
  Top 0.254: IC5-USBIZI100.95 42.85,43.49 46.35,46.99 69.47,46.99 71.88,49.4 75.06,49.4 JP3.4
IO52
  Top 0.254: IC5-USBIZI100.94 43.35,43.23 46.61,46.48 70.87,46.48 72.52,48.13 73.53,48.13 JP3.3
IO53
  Top 0.254: IC5-USBIZI100.93 43.85,42.97 46.86,45.97 71.63,45.97 72.64,46.99 74.93,46.99 JP3.6
IO54
  Top 0.254: IC5-USBIZI100.92 44.35,42.7 47.12,45.47 73.41,45.47 JP3.5
IO55
  Top 0.254: IC5-USBIZI100.91 44.85,42.44 47.37,44.96 71.63,44.96 72.14,44.45 74.93,44.45 JP3.8
IO56
  Top 0.254: IC5-USBIZI100.90 45.35,42.18 47.62,44.45 71.37,44.45 72.64,43.18 JP3.7
IO57
  Top 0.254: IC5-USBIZI100.89 45.85,41.92 47.88,43.94 70.48,43.94 72.52,41.91 74.93,41.91 JP3.10
IO58
  Top 0.254: IC5-USBIZI100.88 46.35,41.66 48.13,43.43 69.98,43.43 72.9,40.51 73.53,40.51 JP3.9
IO59
  Top 0.254: IC5-USBIZI100.87 46.85,41.39 48.39,42.93 68.96,42.93 72.52,39.37 74.93,39.37 JP3.12
IO60
  Top 0.254: IC5-USBIZI100.86 47.35,41.13 48.64,42.42 68.2,42.42 72.52,38.1 JP3.11
IO61
  Top 0.254: IC5-USBIZI100.36 45.35,14.08 47.5,11.94 68.33,11.94 72.14,8.13 72.14,7.24 73.03,6.35 73.28,6.35 73.91,6.35 74.93,6.35 JP3.36
IO62
  Top 0.254: IC5-USBIZI100.37 45.85,14.34 47.75,12.45 68.58,12.45 73.41,7.62 JP3.35
IO63
  Top 0.254: IC5-USBIZI100.38 46.35,14.61 48.01,12.95 68.96,12.95 73.03,8.89 74.93,8.89 JP3.34
IO64
  Top 0.254: IC5-USBIZI100.39 46.85,14.99 48.39,13.46 69.47,13.46 72.77,10.16 JP3.33
IO65
  Top 0.254: IC5-USBIZI100.40 47.35,15.26 48.64,13.97 69.98,13.97 72.52,11.43 74.93,11.43 JP3.32
IO66
  Top 0.254: IC5-USBIZI100.44 49.35,19.86 54.23,14.99 70.87,14.99 71.88,13.97 74.93,13.97 JP3.30
IO67
  Top 0.254: IC5-USBIZI100.45 49.85,20.12 54.48,15.49 73.41,15.49 JP3.29
IO68
  Top 0.254: IC5-USBIZI100.27 40.85,20.03 39.75,18.92 39.75,13.46 41.91,11.3 68.2,11.3 71.5,8 71.5,6.6 73.15,4.95 73.53,4.95 JP3.37
IO69  (via drill 0.38, 0.41)
  Top 0.254: v4.32,44.7 1.31,44.7 R22.2 | 14.22,44.22 14.49,43.96 v14.48,43.94 14.48,45.21 12.05,47.64 R1.1 | IC5-USBIZI100.26 40.35,20.8 v37.34,17.78
  Bottom 0.254: v4.32,44.7 5.08,43.94 v14.48,43.94 21.72,36.7 34.67,36.7 36.2,35.18 43.56,35.18 44.58,34.16 44.58,32 43.81,31.24 41.91,31.24 37.34,26.67 v37.34,17.78
MISO0/IO40*  (via drill 0.41)
  Top 0.254: IC5-USBIZI100.61 48.88,28.59 v46.1,31.37
  Bottom 0.254: v46.1,31.37 46.35,31.37 46.48,31.5 46.48,35.05 40.26,41.27 34.92,41.27 31.5,44.7 J1.5
MOSI0/IO41*  (via drill 0.41)
  Top 0.254: IC5-USBIZI100.60 47.47,28.09 v45.34,30.23
  Bottom 0.254: v45.34,30.23 46.48,30.23 46.99,30.73 46.99,35.69 40.64,42.04 36.83,42.04 34.04,44.83 J1.4
N$1
  Top 0.254: IC5-USBIZI100.2 37.43,35.09 33.27,39.24 28.96,39.24 JP2.3
N$2
  Top 0.254: IC5-USBIZI100.3 37.16,34.59 33.91,37.85 30.48,37.85 30.35,37.97 JP2.4
N$3
  Top 0.254: JP2.6 34.8,35.43 36.64,33.59 IC5-USBIZI100.5
N$4  (via drill 0.41)
  Top 0.254: IC5-USBIZI100.100 40.35,37.62 40.01,37.97 v39.24,37.97
  Bottom 0.254: v39.24,37.97 33.02,37.97 31.75,39.24 29.08,39.24 27.81,40.51 JP2.1
N$5
  Top 0.254: IC5-USBIZI100.1 37.69,35.59 32.77,40.51 JP2.2
N$6  (via drill 0.61)
  Top 0.406: X7.D+ 8.89,38.1 v9.4,37.59 | v15.88,17.65 17.65,17.65 17.53,18.16 | 17.53,18.16 17.78,18.12 R19.1 | R18.2 17.57,17.74 17.53,18.16
  Bottom 0.406: v9.4,37.59 11.43,37.59 12.7,36.32 12.7,19.81 14.86,17.65 v15.88,17.65
N$7  (via drill 0.61)
  Top 0.406: X7.D- 9.56,38.9 v9.78,39.12 | R17.2 v15.75,20.07
  Bottom 0.406: v9.78,39.12 11.56,39.12 13.97,36.7 13.97,21.84 v15.75,20.07
N$8
  Top 0.254: T3.3 24.75,17.17 R20.2
N$9
  Top 0.254: IC5-USBIZI100.4 36.9,34.09 34.29,36.7 28.83,36.7 27.69,35.56 JP2.5
N$10
  Top 0.254: T3.1 20.04,18.77 19.43,18.16 19.54,18.14 R19.2
N$11
  Top 0.254: R21.2 9.27,44.7 9.53,44.96
  Top 0.406: X7.VBUS 6.66,39.7 6.35,40.01
  Top 1.016: 6.35,40.01 8.38,40.01 9.53,41.15 9.53,44.96 9.53,45.34 8,46.86 8,50.29 7.24,50.42 D4.A
N$12
  Top 0.254: R22.1 LED.A
N$13
  Top 0.254: IC5-USBIZI100.16 34.14,28.09 32.38,29.84 C2.1 30.61,30.48 Q2.2
N$14  (via drill 0.38)
  Top 0.254: IC5-USBIZI100.18 31.46,27.09 Q2.1 | C1.1 32.4,32.91 32.4,33.67 v32.64,33.91
  Bottom 0.254: v32.64,33.91 32.64,29.21 31.5,28.07 Q2.1
N$15
  Top 1.016: C12.+ 4.55,21.23 3.68,22.1 3.68,24.11 IC3.2 IC3.4
  pour Top (rank 2): 10.03,52.96 0.64,52.96 0.51,0.38 10.03,0.38 10.03,8.51
N$16
  pour Top: 28.32,30.99 28.32,27.43 19.56,27.43 19.56,30.99
PWM1/IO35  (via drill 0.41)
  Top 0.254: IC5-USBIZI100.32 43.35,18.72 42.29,17.65 42.29,16.38 v42.93,15.75
  Bottom 0.254: v42.93,15.75 42.29,15.75 38.86,19.18 38.86,27.3 40.51,28.96 46.61,28.96 47.62,29.97 47.62,36.2 40.77,43.05 38.61,43.05 36.45,45.21 36.45,50.67 J1.3
PWM2/IO25  (via drill 0.41)
  Top 0.254: IC5-USBIZI100.34 44.35,18.07 v43.18,16.89
  Bottom 0.254: v43.18,16.89 43.05,17.02 42.55,17.02 39.5,20.07 39.5,27.18 40.64,28.32 46.99,28.32 48.39,29.72 48.39,36.7 39.12,45.97 J1.2
PWM3/IO23  (via drill 0.41)
  Top 0.254: IC5-USBIZI100.35 44.85,16.91 v44.32,16.13
  Bottom 0.254: J1.1 41.69,50.3 41.66,50.27 41.66,45.21 49.15,37.72 49.15,29.34 47.62,27.81 41.4,27.81 40.13,26.54 40.13,20.45 42.29,18.29 43.18,18.29 44.32,17.14 v44.32,16.13
PWM5/IO2*  (via drill 0.41)
  Top 0.254: IC5-USBIZI100.69 53.13,32.59 v52.7,33.02
  Bottom 0.254: v52.7,33.02 52.7,45.09 50.67,47.12 50.67,50.67 JP1.6
PWM6/IO7*  (via drill 0.41)
  Top 0.254: IC5-USBIZI100.68 52.79,32.09 v52.45,31.75
  Bottom 0.254: JP1.7 48.26,46.74 51.69,43.31 51.69,32.64 51.69,32 52.07,31.62 52.32,31.62 v52.45,31.75
RD1/IO19*  (via drill 0.38, 0.41)
  Top 0.254: IC5-USBIZI100.46 50.35,25.59 v49.28,26.67 | v44.07,48.77 52.58,48.77 53.34,49.53 JP1.5
  Bottom 0.254: v49.28,26.67 50.16,27.56 50.42,27.81 50.42,41.02 44.07,47.37 v44.07,48.77
RESET#  (via drill 0.38, 0.41)
  Top 0.254: 32.66,3.79 32.66,2.54 JP4.1 30.86,4.7 30.86,10.79 30.86,13.46 29.84,14.73 v29.84,17.14 | IC5-USBIZI100.17 33.24,27.59 31.5,29.34 29.97,29.34 28.96,30.35 28.96,32 28.45,32.51 JP2.7 | RST.2 16.35,37.17 v16.38,38.35
  Top 0.305: C20.1 32.54,10.65 R25.2 31.03,10.63 30.86,10.79
  Bottom 0.254: v29.84,17.14 28.83,17.14 24.51,21.46 24.51,30.1 27.3,32.89 JP2.7 27.69,32.77 20.83,32.77 16.51,37.08 16.51,38.35 v16.38,38.35
RXD0/IO20*  (via drill 0.41)
  Top 0.254: IC5-USBIZI100.99 40.85,43.65 45.21,48.01 58.93,48.01 v59.44,48.51
  Bottom 0.254: v59.44,48.51 61.21,48.51 JP1.1
SCK0/IO42*  (via drill 0.41)
  Top 0.254: IC5-USBIZI100.62 49.78,29.09 46.23,32.64 v45.59,32.64
  Bottom 0.254: v45.59,32.64 45.59,34.8 39.88,40.51 34.67,40.51 29.08,46.1 29.08,50.67 J1.6
SCL0/IO31*  (via drill 0.41)
  Top 0.254: v41.78,25.53 41.15,24.89 39.88,24.89 39.08,24.09 IC5-USBIZI100.24 36.66,24.09 35.31,22.73 35.31,21.42 R15.1
  Bottom 0.254: v41.78,25.53 41.91,25.53 42.16,25.78 53.85,25.78 57.91,29.84 57.91,44.83 55.88,46.86 JP1.4
SDA0/IO33*  (via drill 0.41)
  Top 0.254: v41.78,24.26 40.13,24.26 39.47,23.59 IC5-USBIZI100.25 37.56,23.59 36.96,22.99 36.96,21.55 R16.1
  Bottom 0.254: v41.78,24.26 42.04,24.26 43.05,25.27 54.1,25.27 60.07,31.24 60.07,45.72 58.42,47.37 JP1.3
TD1/IO15*  (via drill 0.41)
  Top 0.254: IC5-USBIZI100.47 50.85,26.47 50.93,26.54 v50.93,26.67
  Bottom 0.254: 45.59,50.67 JP1.8 45.72,47.5 | v50.93,26.67 51.18,26.8
  Bottom 0.305: 45.72,47.5 50.93,42.29 v50.93,26.67
TXD0/IO18*
  Top 0.254: IC5-USBIZI100.98 41.35,43.26 45.59,47.5 60.07,47.5 60.96,48.39 JP1.2
USB_CON  (via drill 0.41)
  Top 0.254: IC5-USBIZI100.64 51.32,30.09 47.12,34.29 42.55,34.29 v42.16,33.78 | R20.1 26.63,18.88 v27.81,20.07
  Bottom 0.254: 27.94,20.07 v27.81,20.07 27.94,19.94 28.83,19.94 42.16,33.27 v42.16,33.78
VBAT  (via drill 0.41)
  Top 0.254: v21.84,35.56 21.84,45.47 23.88,47.5 J1.8 23.32,51.36 D1.C | v29.21,26.67 29.16,26.59 IC5-USBIZI100.19
  Bottom 0.254: v21.84,35.56 23.24,34.16 28.32,34.16 28.96,33.53 28.96,27.18 v29.21,26.67
VBUS/E36*  (via drill 0.41, 0.61)
  Top 0.254: IC5-USBIZI100.65 51.96,30.59 47.5,35.05 41.15,35.05 39.12,37.08 38.23,37.08 31.75,43.56 28.07,43.56 v26.67,44.96 | v6.22,46.61 6.22,44.74 R21.1
  Bottom 0.254: v26.67,44.96 7.87,44.96 v6.22,46.61
VCC
  Top 0.254: 37.85,30.1 37.85,30.09 IC5-USBIZI100.12 IC5-USBIZI100.13 | 37.85,30.1 37.59,29.72 37.47,29.59 | 37.47,29.59 37.34,29.72 37.85,30.1 | 37.85,30.1 39.5,30.1 | IC5-USBIZI100.42 48.35,19.08 49.66,17.78 C3.1 | IC5-USBIZI100.13 39.62,29.59 | 37.47,29.59 IC5-USBIZI100.13 | IC5-USBIZI100.10 37.74,31.09 37.34,31.5
  pour Top (rank 4): 81.92,-0.13 81.92,52.83 10.29,52.96 10.29,0
VIN
  Top 0.406: 11.71,8.67 11.71,8.22 PWR1.+
  Top 1.27: 11.71,8.67 12.06,9.02 12.06,15.11 12.7,15.75 D3.A
  Bottom 0.406: 11.97,7.11 12.6,7.33 PWR1.+
  Bottom 1.27: JP4.6 45.72,4.83 43.43,7.11 11.97,7.11
XTAL1
  Top 0.254: C15.1 15.75,24.12 X8.1 21.41,24.33 | 21.41,24.33 21.46,24.51 | 21.41,24.33 22.73,25.65 34.04,25.65 34.6,25.09 IC5-USBIZI100.22
XTAL2
  Top 0.254: IC5-USBIZI100.23 31.42,24.59 X8.2 31.24,23.35 C16.1

### Text on the board
tPlace: 3V3 | GND | 13 | 12 | 11 | 10 | D9 | D8 | D7 | D6 | D5 | D4 | D3 | D2 | D1 | D0 | D20 | D21 | BAT | GND | D22 | D23 | SCK1 | MISO1 | MOSI1 | PWM1 | PWM2 | PWM3 | CAN1T | PWM6 | PWM5 | CAN1R | D24 | D25 | 1 | 2 | SCL *OD* | SDA *OD* | COM1 OUT | COM1 IN | D26 | D27 | D28 | D29 | JTAG | D30 | D31 | D32 | D33 | 7 | D43 | RTS | + | D41 | CTS | D34 | GND | D39 | TXD | COM2 | D37 | RXD | D35 | MOD | D42 | TXD | 3 | D36 | D37 | COM | D40 | RXD | D33 | TXD | D38 | D39 | 4 | D31 | RXD | COM | D40 | D41 | + | D36 | MISO | FEZ Panda II | D42 | D43 | D38 | MOSI | Rev D | D35 | CLK | SPI2 | D44 | D45 | www.GHIElectronics.com | D32 | TD | GHI Electronics, LLC | 2 | D46 | D47 | D30 | RD | CAN | D48 | D49 | Analog | & | Digital | D50 | D51 | 5V | GND | D52 | GND | RST | 3V3 | Vin | A0 | A1 | A2 | A3 | A4 | A5 | 5V | 3V3 | 6 to 9V | - | +
bPlace: www.GHIElectronics.com | GHI Electronics, LLC | www.TinyCLR.com | FEZ Panda II | Based on GHI's USBizi Chipset
Reference: C8 | R7 | R5 | R6 | R4 | C3 | C2 | R9 | R8 | R1 | R2 | C1 | C4 | C5 | X2 | C7 | C6